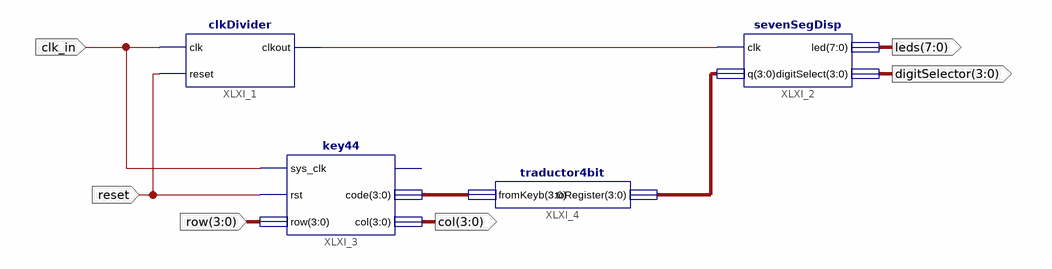
[diagram p0: schematic sheet 1]
// Xilinx ISE schematic top.sch (spartan3e) as structural Verilog: 4 symbols, 6 ports
module top (
  input  clk_in,
  input  reset,
  input  [3:0] row,
  output [7:0] leds,
  output [3:0] digitSelector,
  output [3:0] col
);

  wire XLXN_3;
  wire [3:0] XLXN_14, XLXN_15;

  clkDivider XLXI_1 (.clk(clk_in), .reset(reset), .clkout(XLXN_3));
  sevenSegDisp XLXI_2 (.clk(XLXN_3), .q(XLXN_15), .led(leds), .digitSelect(digitSelector));
  traductor4bit XLXI_4 (.fromKeyb(XLXN_14), .toRegister(XLXN_15));
  key44 XLXI_3 (.sys_clk(clk_in), .rst(reset), .row(row), .code(XLXN_14), .col(col));  // open: valid
endmodule
